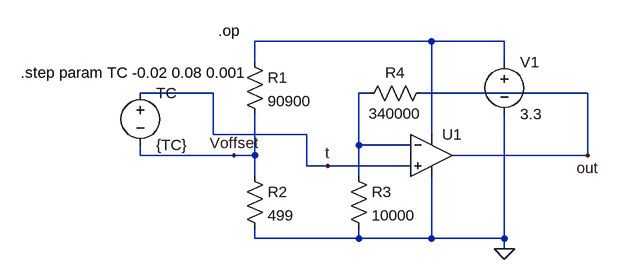
[diagram p0: schematic thermocouple_sim.asc]
thermocouple_sim.asc, the LTspice schematic file:
Version 4.1
SHEET 1 880 680
WIRE 384 0 112 0
WIRE 496 0 384 0
WIRE 112 32 112 0
WIRE 496 32 496 0
WIRE 48 80 -64 80
WIRE 288 80 272 80
WIRE 624 80 368 80
WIRE 48 144 48 80
WIRE 192 144 48 144
WIRE 384 144 384 0
WIRE 272 160 272 80
WIRE 352 160 272 160
WIRE -64 176 -64 160
WIRE 80 176 -64 176
WIRE 112 176 112 112
WIRE 112 176 80 176
WIRE 624 176 624 80
WIRE 624 176 416 176
WIRE 192 192 192 144
WIRE 224 192 192 192
WIRE 352 192 224 192
WIRE 112 208 112 176
WIRE 272 208 272 160
WIRE 112 304 112 288
WIRE 272 304 272 288
WIRE 272 304 112 304
WIRE 384 304 384 208
WIRE 384 304 272 304
WIRE 496 304 496 112
WIRE 496 304 384 304
WIRE 496 320 496 304
FLAG 496 320 0
FLAG 624 176 out
FLAG 224 192 t
FLAG 80 176 Voffset
SYMBOL voltage 496 16 R0
SYMATTR InstName V1
SYMATTR Value 3.3
SYMBOL voltage -64 64 R0
SYMATTR InstName TC
SYMATTR Value {TC}
SYMBOL res 96 16 R0
SYMATTR InstName R1
SYMATTR Value 90900
SYMBOL res 96 192 R0
SYMATTR InstName R2
SYMATTR Value 499
SYMBOL OpAmps\\UniversalOpAmp2 384 176 R0
SYMATTR InstName U1
SYMBOL res 256 192 R0
SYMATTR InstName R3
SYMATTR Value 10000
SYMBOL res 384 64 R90
WINDOW 0 0 56 VBottom 2
WINDOW 3 32 56 VTop 2
SYMATTR InstName R4
SYMATTR Value 340000
TEXT -248 48 Left 2 !.step param TC -0.02 0.08 0.001
TEXT 56 -16 Left 2 !.op

The netlist it stands for:
* thermocouple_sim.asc
V1 N001 0 3.3
V§TC t Voffset {TC}
R1 N001 Voffset 90900
R2 Voffset 0 499
X§U1 t N002 N001 0 out level2 Avol=1Meg GBW=10Meg Slew=10Meg Ilimit=25m Rail=0 Vos=0 En=0 Enk=0 In=0 Ink=0 Rin=500Meg  ; pins In+ In- V+ V- OUT
R3 N002 0 10000
R4 out N002 340000
.step param TC -0.02 0.08 0.001
.op
.lib UniversalOpAmp2.lib
.backanno
.end

* Results of the author's LTspice run, read from the files saved beside the schematic
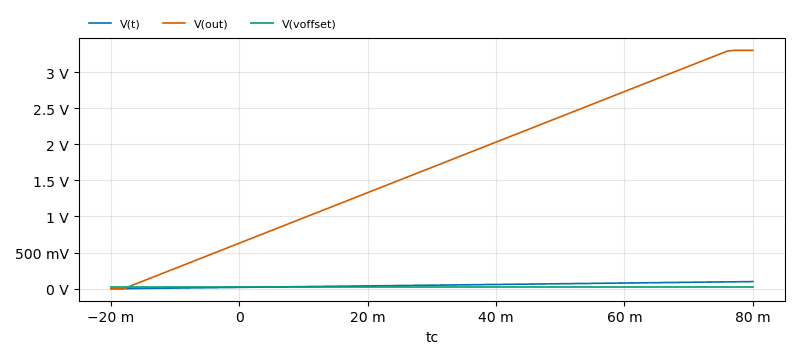
[diagram p1: Operating Point of thermocouple_sim.asc, plotted from the saved traces]
* Operating Point, 1 run:
*   V(t): -1.982 mV at tc=-20 m, 98.02 mV at tc=80 m, min -1.982 mV, max 98.02 mV
*   V(out): 6.156 µV at tc=-20 m, 3.3 V at tc=80 m, min 6.156 µV, max 3.3 V
*   V(voffset): 18.02 mV at tc=-20 m, 18.02 mV at tc=80 m, min 18.02 mV, max 18.02 mV
* From the log:
*   Semiconductor Device Operating Points:
*                           --- Diodes ---
*   Name:     u1:D1       u1:D2
*   Model:      x           x
*   Id:     -3.30e-12   -6.16e-18
*   Vd:     -3.30e+00   -6.16e-06
*   Req:     1.00e-12    1.00e-12
*   CAP:     0.00e+00    0.00e+00